# EAGLE design picaxe-08-trainer (EAGLE 7.2.0)
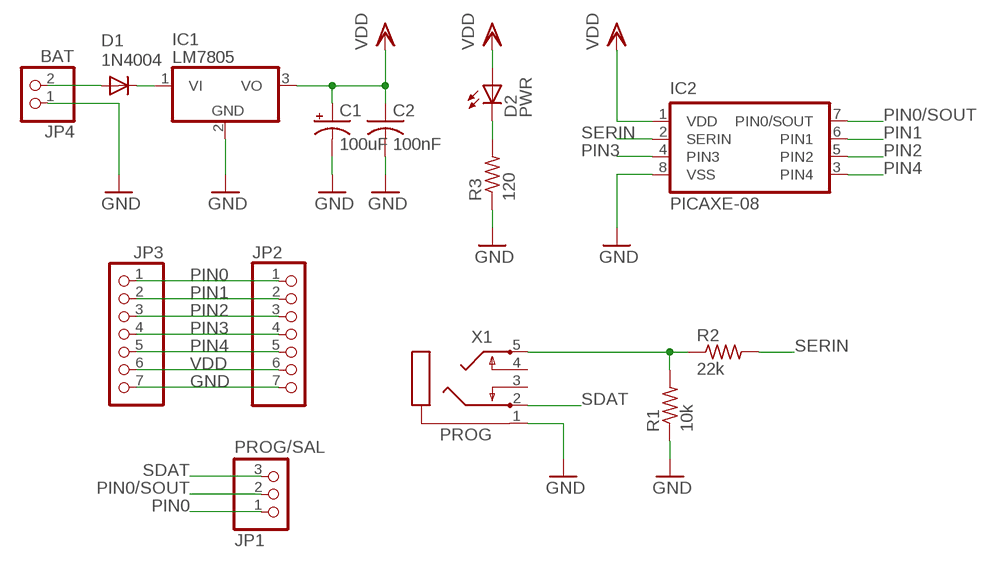
[diagram p0: schematic, sheet 1]

## Parts
C1  100uF  CPOL-USE5-6  [E5-6]
C2  100nF  C-US025-025X050  [C025-025X050]
D1  1N4004  [DO41-10]
D2  PWR  LED3MM  [LED3MM]
IC1  LM7805  7805TV  [TO220V]
IC2  PICAXE-08  [DIL8]
JP1  PROG/SAL  PINHD-1X3  [1X03]
JP2  PINHD-1X7  [1X07]
JP3  PINHD-1X7  [1X07]
JP4  BAT  PINHD-1X2  [1X02]
R1  10k  R-US_0204/7  [0204/7]
R2  22k  R-US_0204/7  [0204/7]
R3  120  R-US_0204/7  [0204/7]
X1  PROG  STEREOJACK  [STX3100]

## Nets
GND: C1.- C2.2 IC1.2(GND) IC2.8(VSS) JP2.7 JP3.7 JP4.1 R1.1 R3.1 X1.1
N$1: D1.C IC1.1(VI)
N$2: R1.2 R2.1 X1.5
N$3: D2.K(C) R3.2
N$4: D1.A JP4.2
PIN0: JP1.1 JP2.1 JP3.1
PIN0/SOUT: IC2.7(PIN0/SOUT) JP1.2
PIN1: IC2.6(PIN1) JP2.2 JP3.2
PIN2: IC2.5(PIN2) JP2.3 JP3.3
PIN3: IC2.4(PIN3) JP2.4 JP3.4
PIN4: IC2.3(PIN4) JP2.5 JP3.5
SDAT: JP1.3 X1.2
SERIN: IC2.2(SERIN) R2.2
VDD: C1.+ C2.1 D2.A IC1.3(VO) IC2.1(VDD) JP2.6 JP3.6
Unconnected: X1.3 X1.4

## Library data of the parts
C1 = rcl:CPOL-US: POLARIZED CAPACITOR, American symbol
C2 = rcl:C-US: CAPACITOR, American symbol
D1 = diode:1N4004: DIODE general purpose rectifier, 1 A
D2 = led:LED: LED OSRAM: - CHIPLED LG R971, LG N971, LY N971, LG Q971, LY Q971, LO R971, LY R971 LH N974, LH R974 LS Q976, LO Q976, LY Q976 LO Q996 - Hyper CHIPLED LW Q18S LB Q993, LB Q99A, LB R99A - SideLED LS A670, LO A670, LY A670, LG A670, LP A670 LB A673, LV A673, LT A673, LW A673 LH A674 LY A675 LS A676, LA A676, LO A676, LY A676, LW A676 LS A679, LY A679, LG A679 - Hyper Micro SIDELED® LS Y876, LA Y876, LO Y876, LY Y876 LT Y87S - SmartLED LW L88C, LW L88S LB L89C, LB L89S, LG L890 LS L89K, LO L89K, LY L89K LS L896, LA L896, LO L896, LY L896 - TOPLED LS T670, LO T670, LY T670, LG T670, LP T670 LSG T670, LSP T670, LSY T670, LOP T670, LYG T670 LG T671, LOG T671, LSG T671 LB T673, LV T673, LT T673, LW T673 LH T674 LS T676, LA T676, LO T676, LY T676, LB T676, LH T676, LSB T676, LW T676 LB T67C, LV T67C, LT T67C, LS T67K, LO T67K, LY T67K, LW E67C LS E67B, LA E67B, LO E67B, LY E67B, LB E67C, LV E67C, LT E67C LW T67C LS T679, LY T679, LG T679 LS T770, LO T770, LY T770, LG T770, LP T770 LB T773, LV T773, LT T773, LW T773 LH T774 LS E675, LA E675, LY E675, LS T675 LS T776, LA T776, LO T776, LY T776, LB T776 LHGB T686 LT T68C, LB T68C - Hyper Mini TOPLED® LB M676 - Mini TOPLED Santana® LG M470 LS M47K, LO M47K, LY M47K Source: http://www.osram.convergy.de LUXEON: - LUMILED® LXK2-PW12-R00, LXK2-PW12-S00, LXK2-PW14-U00, LXK2-PW14-V00 LXK2-PM12-R00, LXK2-PM12-S00, LXK2-PM14-U00 LXK2-PE12-Q00, LXK2-PE12-R00, LXK2-PE12-S00, LXK2-PE14-T00, LXK2-PE14-U00 LXK2-PB12-K00, LXK2-PB12-L00, LXK2-PB12-M00, LXK2-PB14-N00, LXK2-PB14-P00, LXK2-PB14-Q00 LXK2-PR12-L00, LXK2-PR12-M00, LXK2-PR14-Q00, LXK2-PR14-R00 LXK2-PD12-Q00, LXK2-PD12-R00, LXK2-PD12-S00 LXK2-PH12-R00, LXK2-PH12-S00 LXK2-PL12-P00, LXK2-PL12-Q00, LXK2-PL12-R00 Source: www.luxeon.com KINGBRIGHT: KA-3528ASYC Source: www.kingbright.com
IC1 = linear:78*: Positive VOLTAGE REGULATOR Source: http://cache.national.com/ds/LM/LM78L05.pdf http://www.fairchildsemi.com/ds/LM/LM7805.pdf
IC2 = picaxe-4:PICAXE-08: PICAXE-08 Controller 1-4 I/P, 1-4 O/P, 1 ADC
JP1 = pinhead:PINHD-1X3: PIN HEADER
JP2 JP3 = pinhead:PINHD-1X7: PIN HEADER
JP4 = pinhead:PINHD-1X2: PIN HEADER
R1-R3 = resistor:R-US_: RESISTOR, American symbol
X1 = adafruit:STEREOJACK: MIC/HEADPHONE JACK Stereo jack with two switches. Kycon STX3100, CUI SJ1-3555NG and/or 4UCon 05544

## Board
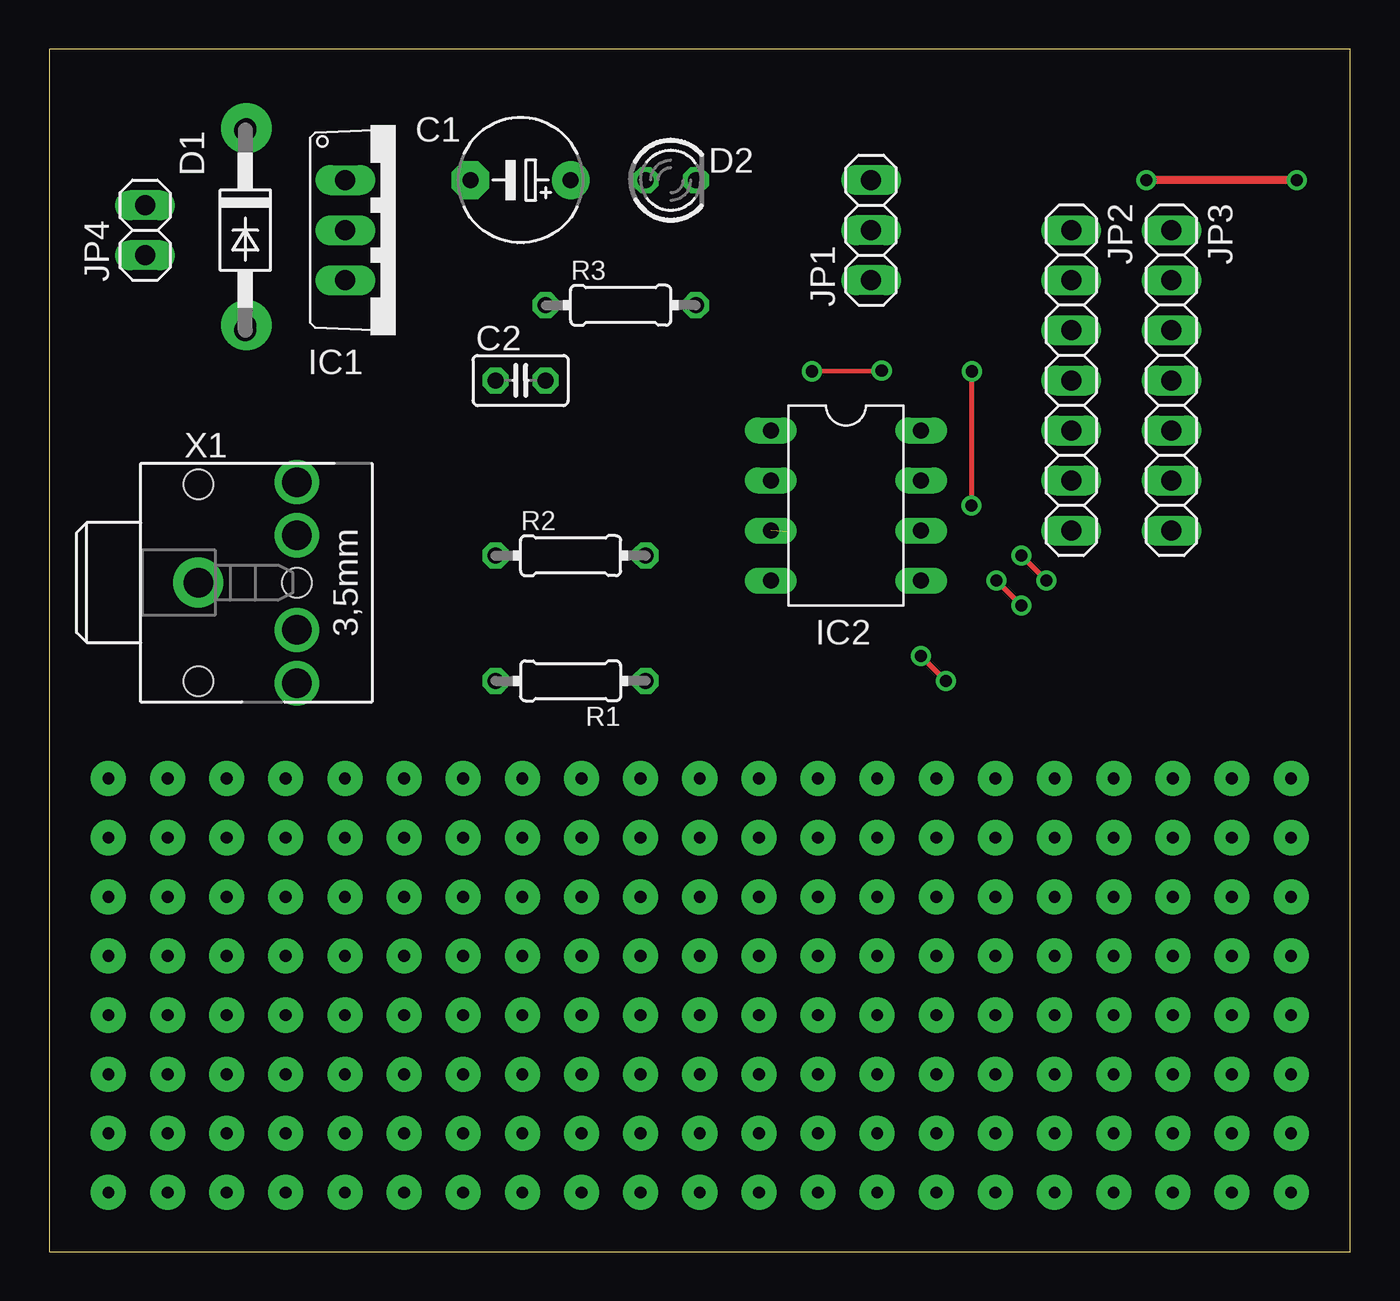
[diagram p1: board, top side]
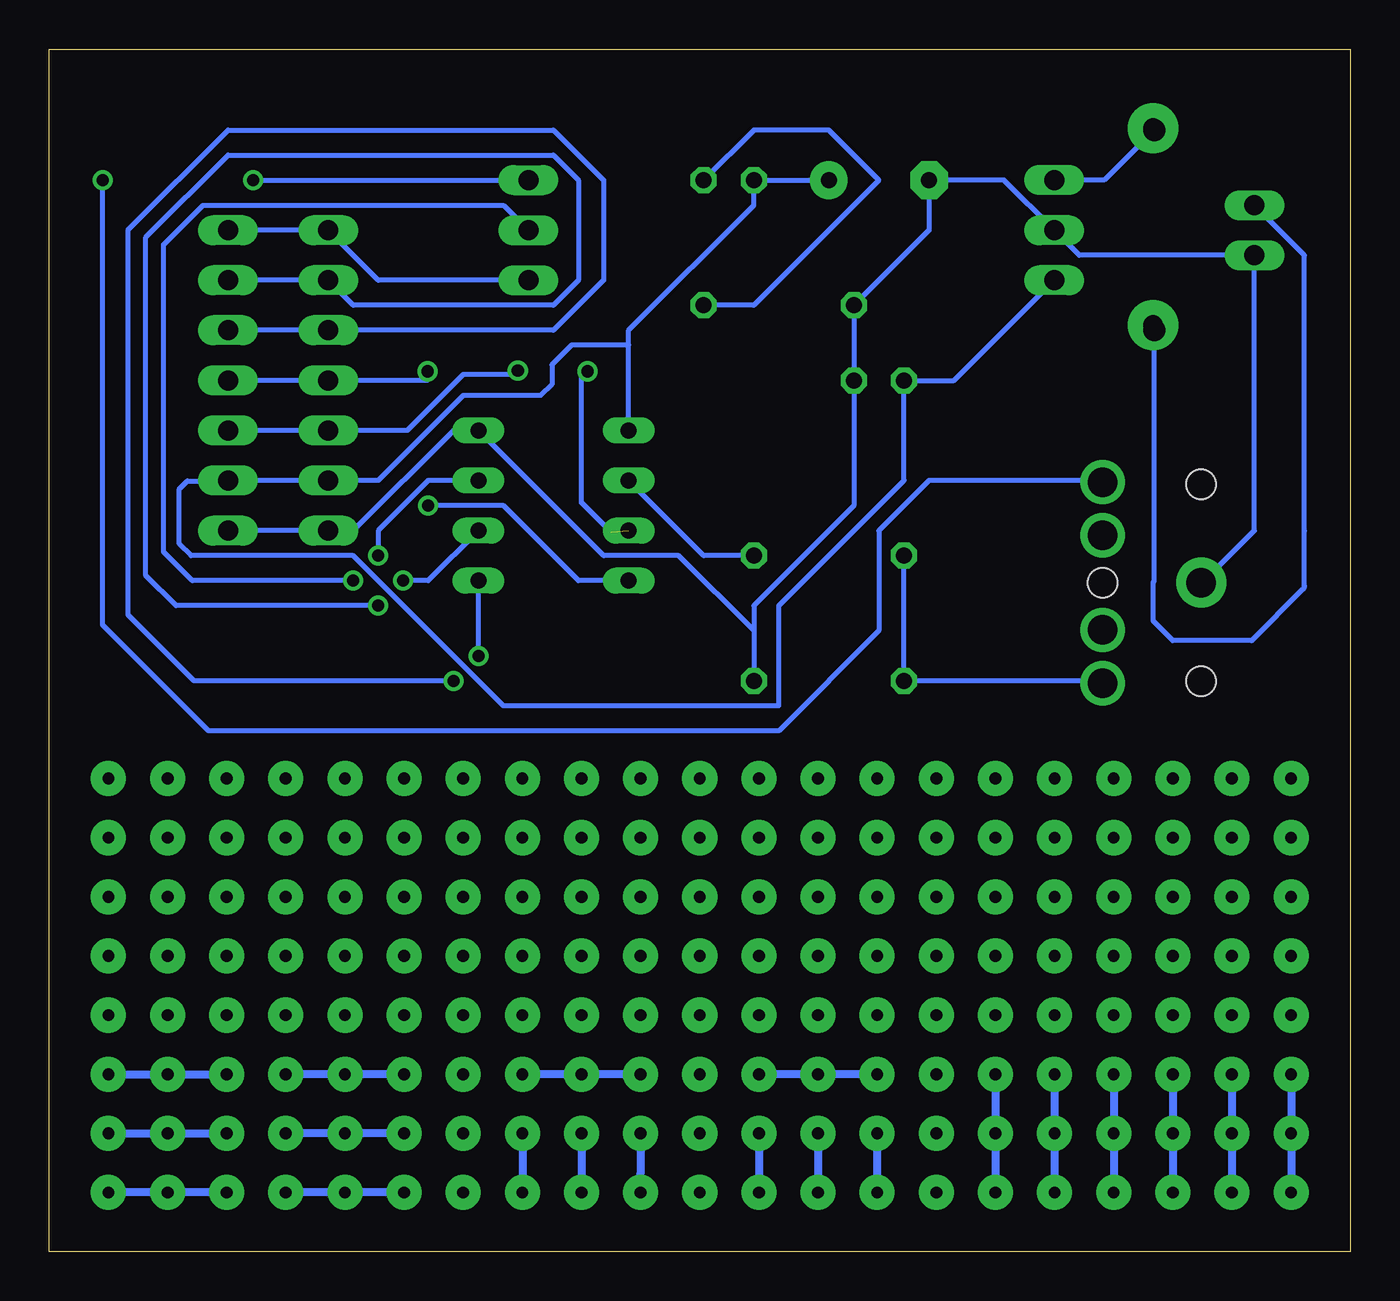
[diagram p2: board, bottom side, seen from below]

Size 66 x 61 mm. Coordinates in mm from the lower left corner, seen from the top.
Outline: 0,0 66,0 66,61 0,61 0,0
Copper layers (1*16): Top 0.035mm / dielectric 1.5mm / Bottom 0.035mm
Design rules "default": minimum track width 10mil, minimum drill 24mil, track to track 8mil, track to pad 8mil, pad to pad 8mil, via to via 8mil, smd to smd 8mil, copper to edge 40mil, drill to drill 8mil, minimum pad ring 10mil, minimum via ring 8mil, stop-mask expansion 4mil, vias tented up to drill 0mil, thermal gap 10mil

### Footprints (pad centres in the part's own frame; a part is rotated, then mirrored left to right if it is on the bottom)
E5-6 = drill 0.813 pad 1.905: + -2.54,0 | drill 0.813 pad 1.905 octagon: - 2.54,0
C025-025X050 = drill 0.813 octagon: 1 -1.27,0; 2 1.27,0
DO41-10 = drill 1.118: A 5.08,0; C -5.08,0
LED3MM = drill 0.813 octagon: A -1.27,0; K 1.27,0
TO220V = drill 1.016 long: 1 -2.54,-2.54; 2 0,-2.54; 3 2.54,-2.54
DIL8 = drill 0.813 long: 1 -3.81,-3.81; 2 -1.27,-3.81; 3 1.27,-3.81; 4 3.81,-3.81; 5 3.81,3.81; 6 1.27,3.81; 7 -1.27,3.81; 8 -3.81,3.81
1X03 = drill 1.016 long: 1 -2.54,0; 2 0,0; 3 2.54,0
1X07 = drill 1.016 long: 1 -7.62,0; 2 -5.08,0; 3 -2.54,0; 4 0,0; 5 2.54,0; 6 5.08,0; 7 7.62,0
1X02 = drill 1.016 long: 1 -1.27,0; 2 1.27,0
0204/7 = drill 0.813 octagon: 1 -3.81,0; 2 3.81,0
STX3100 = drill 1.5 pad 2.54: 1 2.7,-0.1 | drill 1.5: 2 7.7,5; 3 7.7,2.3; 4 7.7,-2.5; 5 7.7,-5.2 | hole 1.5: 2.7,4.9; 2.7,-5.1; 7.7,-0.1

### Placement (x,y rotation side)
C1  23.91,54.36 180 top
C2  23.91,44.2 0 top
D1  9.94,51.82 270 top
D2  31.53,54.36 0 top
IC1  17.56,51.82 270 top
IC2  40.42,37.85 270 top
JP1  41.69,51.82 90 top
JP2  51.85,44.2 270 top
JP3  56.93,44.2 270 top
JP4  4.86,51.82 90 top
R1  26.45,28.96 180 top
R2  26.45,35.31 0 top
R3  28.99,48.01 0 top
X1  4.86,34.04 0 top

### Tracks (layer width: path | path; a pad name or v marks a point on that pad's centre or on a via)
GND
  Bottom 0.254: X1.1 7.4,34.04 4.86,36.58 JP4.1 13.75,50.55 IC1.2 17.56,54.36 C1.- 21.37,51.82 R3.1 C2.2 25.18,37.85 30.26,32.77 30.26,31.5 | 30.26,31.5 R1.1 | 30.26,31.5 34.07,35.31 37.88,35.31 IC2.8 45.5,41.66 50.58,36.58 JP2.7 JP3.7
N$1
  Bottom 0.254: IC1.1 12.48,54.36 D1.C
N$2
  Bottom 0.254: R2.1 R1.2 12.48,28.96 X1.5
N$3
  Bottom 0.254: R3.2 30.26,48.01 23.91,54.36 26.45,56.9 30.26,56.9 D2.K
N$4
  Bottom 0.254: JP4.2 2.32,50.55 2.32,36.58 2.32,33.78 arc45 2.39,33.61 5,31 9,31 10,32 10,33.89 arc45 9.94,34.04 D1.A
N$5  (via drill 1 pad 2.54)
  other vias: 10,57
N$6  (via drill 1 pad 2.54)
  other vias: 10,47
N$7  (via drill 0.6 pad 1.78)
  other vias: 3,24
N$8  (via drill 0.6 pad 1.78)
  other vias: 6,24
N$9  (via drill 0.6 pad 1.78)
  other vias: 9,24
N$10  (via drill 0.6 pad 1.78)
  other vias: 12,24
N$11  (via drill 0.6 pad 1.78)
  other vias: 15,24
N$12  (via drill 0.6 pad 1.78)
  other vias: 18,24
N$13  (via drill 0.6 pad 1.78)
  other vias: 21,24
N$14  (via drill 0.6 pad 1.78)
  other vias: 24,24
N$15  (via drill 0.6 pad 1.78)
  other vias: 27,24
N$16  (via drill 0.6 pad 1.78)
  other vias: 30,24
N$17  (via drill 0.6 pad 1.78)
  other vias: 33,24
N$18  (via drill 0.6 pad 1.78)
  other vias: 36,24
N$19  (via drill 0.6 pad 1.78)
  other vias: 39,24
N$20  (via drill 0.6 pad 1.78)
  other vias: 42,24
N$21  (via drill 0.6 pad 1.78)
  other vias: 45,24
N$22  (via drill 0.6 pad 1.78)
  other vias: 48,24
N$23  (via drill 0.6 pad 1.78)
  other vias: 51,24
N$24  (via drill 0.6 pad 1.78)
  other vias: 54,24
N$25  (via drill 0.6 pad 1.78)
  other vias: 57,24
N$26  (via drill 0.6 pad 1.78)
  other vias: 60,24
N$27  (via drill 0.6 pad 1.78)
  other vias: 63,24
N$28  (via drill 0.6 pad 1.78)
  other vias: 3,21
N$29  (via drill 0.6 pad 1.78)
  other vias: 6,21
N$30  (via drill 0.6 pad 1.78)
  other vias: 9,21
N$31  (via drill 0.6 pad 1.78)
  other vias: 12,21
N$32  (via drill 0.6 pad 1.78)
  other vias: 15,21
N$33  (via drill 0.6 pad 1.78)
  other vias: 18,21
N$34  (via drill 0.6 pad 1.78)
  other vias: 21,21
N$35  (via drill 0.6 pad 1.78)
  other vias: 24,21
N$36  (via drill 0.6 pad 1.78)
  other vias: 27,21
N$37  (via drill 0.6 pad 1.78)
  other vias: 30,21
N$38  (via drill 0.6 pad 1.78)
  other vias: 33,21
N$39  (via drill 0.6 pad 1.78)
  other vias: 36,21
N$40  (via drill 0.6 pad 1.78)
  other vias: 39,21
N$41  (via drill 0.6 pad 1.78)
  other vias: 42,21
N$42  (via drill 0.6 pad 1.78)
  other vias: 45,21
N$43  (via drill 0.6 pad 1.78)
  other vias: 48,21
N$44  (via drill 0.6 pad 1.78)
  other vias: 51,21
N$45  (via drill 0.6 pad 1.78)
  other vias: 54,21
N$46  (via drill 0.6 pad 1.78)
  other vias: 57,21
N$47  (via drill 0.6 pad 1.78)
  other vias: 60,21
N$48  (via drill 0.6 pad 1.78)
  other vias: 63,21
N$49  (via drill 0.6 pad 1.78)
  other vias: 3,18
N$50  (via drill 0.6 pad 1.78)
  other vias: 6,18
N$51  (via drill 0.6 pad 1.78)
  other vias: 9,18
N$52  (via drill 0.6 pad 1.78)
  other vias: 12,18
N$53  (via drill 0.6 pad 1.78)
  other vias: 15,18
N$54  (via drill 0.6 pad 1.78)
  other vias: 18,18
N$55  (via drill 0.6 pad 1.78)
  other vias: 21,18
N$56  (via drill 0.6 pad 1.78)
  other vias: 24,18
N$57  (via drill 0.6 pad 1.78)
  other vias: 27,18
N$58  (via drill 0.6 pad 1.78)
  other vias: 30,18
N$59  (via drill 0.6 pad 1.78)
  other vias: 33,18
N$60  (via drill 0.6 pad 1.78)
  other vias: 36,18
N$61  (via drill 0.6 pad 1.78)
  other vias: 39,18
N$62  (via drill 0.6 pad 1.78)
  other vias: 42,18
N$63  (via drill 0.6 pad 1.78)
  other vias: 45,18
N$64  (via drill 0.6 pad 1.78)
  other vias: 48,18
N$65  (via drill 0.6 pad 1.78)
  other vias: 51,18
N$66  (via drill 0.6 pad 1.78)
  other vias: 54,18
N$67  (via drill 0.6 pad 1.78)
  other vias: 57,18
N$68  (via drill 0.6 pad 1.78)
  other vias: 60,18
N$69  (via drill 0.6 pad 1.78)
  other vias: 63,18
N$70  (via drill 0.6 pad 1.78)
  other vias: 3,15
N$71  (via drill 0.6 pad 1.78)
  other vias: 6,15
N$72  (via drill 0.6 pad 1.78)
  other vias: 9,15
N$73  (via drill 0.6 pad 1.78)
  other vias: 12,15
N$74  (via drill 0.6 pad 1.78)
  other vias: 15,15
N$75  (via drill 0.6 pad 1.78)
  other vias: 18,15
N$76  (via drill 0.6 pad 1.78)
  other vias: 21,15
N$77  (via drill 0.6 pad 1.78)
  other vias: 24,15
N$78  (via drill 0.6 pad 1.78)
  other vias: 27,15
N$79  (via drill 0.6 pad 1.78)
  other vias: 30,15
N$80  (via drill 0.6 pad 1.78)
  other vias: 33,15
N$81  (via drill 0.6 pad 1.78)
  other vias: 36,15
N$82  (via drill 0.6 pad 1.78)
  other vias: 39,15
N$83  (via drill 0.6 pad 1.78)
  other vias: 42,15
N$84  (via drill 0.6 pad 1.78)
  other vias: 45,15
N$85  (via drill 0.6 pad 1.78)
  other vias: 48,15
N$86  (via drill 0.6 pad 1.78)
  other vias: 51,15
N$87  (via drill 0.6 pad 1.78)
  other vias: 54,15
N$88  (via drill 0.6 pad 1.78)
  other vias: 57,15
N$89  (via drill 0.6 pad 1.78)
  other vias: 60,15
N$90  (via drill 0.6 pad 1.78)
  other vias: 63,15
N$91  (via drill 0.6 pad 1.78)
  other vias: 3,12
N$92  (via drill 0.6 pad 1.78)
  other vias: 6,12
N$93  (via drill 0.6 pad 1.78)
  other vias: 9,12
N$94  (via drill 0.6 pad 1.78)
  other vias: 12,12
N$95  (via drill 0.6 pad 1.78)
  other vias: 15,12
N$96  (via drill 0.6 pad 1.78)
  other vias: 18,12
N$97  (via drill 0.6 pad 1.78)
  other vias: 21,12
N$98  (via drill 0.6 pad 1.78)
  other vias: 24,12
N$99  (via drill 0.6 pad 1.78)
  other vias: 27,12
N$100  (via drill 0.6 pad 1.78)
  other vias: 30,12
N$101  (via drill 0.6 pad 1.78)
  other vias: 33,12
N$102  (via drill 0.6 pad 1.78)
  other vias: 36,12
N$103  (via drill 0.6 pad 1.78)
  other vias: 39,12
N$104  (via drill 0.6 pad 1.78)
  other vias: 42,12
N$105  (via drill 0.6 pad 1.78)
  other vias: 45,12
N$106  (via drill 0.6 pad 1.78)
  other vias: 48,12
N$107  (via drill 0.6 pad 1.78)
  other vias: 51,12
N$108  (via drill 0.6 pad 1.78)
  other vias: 54,12
N$109  (via drill 0.6 pad 1.78)
  other vias: 57,12
N$110  (via drill 0.6 pad 1.78)
  other vias: 60,12
N$111  (via drill 0.6 pad 1.78)
  other vias: 63,12
N$112  (via drill 0.6 pad 1.78)
  Bottom 0.406: v3,9 v3,3
N$113  (via drill 0.6 pad 1.78)
  Bottom 0.406: v6,9 v6,3
N$114  (via drill 0.6 pad 1.78)
  Bottom 0.406: v9,9 v9,3
N$115  (via drill 0.6 pad 1.78)
  Bottom 0.406: v12,9 v12,3
N$116  (via drill 0.6 pad 1.78)
  Bottom 0.406: v15,9 v15,3
N$117  (via drill 0.6 pad 1.78)
  Bottom 0.406: v18,9 v18,3
N$118  (via drill 0.6 pad 1.78)
  other vias: 21,9
N$119  (via drill 0.6 pad 1.78)
  Bottom 0.406: v24,9 v30,9
N$120  (via drill 0.6 pad 1.78)
  other vias: 27,9
N$122  (via drill 0.6 pad 1.78)
  other vias: 33,9
N$123  (via drill 0.6 pad 1.78)
  Bottom 0.406: v36,9 v42,9
N$124  (via drill 0.6 pad 1.78)
  other vias: 39,9
N$126  (via drill 0.6 pad 1.78)
  other vias: 45,9
N$127  (via drill 0.6 pad 1.78)
  Bottom 0.406: v48,9 v54,9
N$128  (via drill 0.6 pad 1.78)
  other vias: 51,9
N$131  (via drill 0.6 pad 1.78)
  other vias: 60,9
N$132  (via drill 0.6 pad 1.78)
  Bottom 0.406: v63,9 v57,9
N$133  (via drill 0.6 pad 1.78)
  other vias: 3,6
N$134  (via drill 0.6 pad 1.78)
  other vias: 6,6
N$135  (via drill 0.6 pad 1.78)
  other vias: 9,6
N$136  (via drill 0.6 pad 1.78)
  other vias: 12,6
N$137  (via drill 0.6 pad 1.78)
  other vias: 15,6
N$138  (via drill 0.6 pad 1.78)
  other vias: 18,6
N$139  (via drill 0.6 pad 1.78)
  other vias: 21,6
N$140  (via drill 0.6 pad 1.78)
  Bottom 0.406: v24,6 v24,3
N$141  (via drill 0.6 pad 1.78)
  Bottom 0.406: v27,6 v27,3
N$142  (via drill 0.6 pad 1.78)
  Bottom 0.406: v30,6 v30,3
N$143  (via drill 0.6 pad 1.78)
  other vias: 33,6
N$144  (via drill 0.6 pad 1.78)
  Bottom 0.406: v36,6 36,4 v36,3
N$145  (via drill 0.6 pad 1.78)
  Bottom 0.406: v39,6 v39,3
N$146  (via drill 0.6 pad 1.78)
  Bottom 0.406: v42,6 v42,3
N$147  (via drill 0.6 pad 1.78)
  other vias: 45,6
N$148  (via drill 0.6 pad 1.78)
  Bottom 0.406: v48,6 v54,6
N$149  (via drill 0.6 pad 1.78)
  other vias: 51,6
N$152  (via drill 0.6 pad 1.78)
  other vias: 60,6
N$153  (via drill 0.6 pad 1.78)
  Bottom 0.406: v63,6 v57,6
N$160  (via drill 0.6 pad 1.78)
  other vias: 21,3
N$164  (via drill 0.6 pad 1.78)
  other vias: 33,3
N$168  (via drill 0.6 pad 1.78)
  other vias: 45,3
N$169  (via drill 0.6 pad 1.78)
  Bottom 0.406: v48,3 v54,3
N$170  (via drill 0.6 pad 1.78)
  other vias: 51,3
N$172  (via drill 0.6 pad 1.78)
  Bottom 0.406: v57,3 v63,3
N$173  (via drill 0.6 pad 1.78)
  other vias: 60,3
PIN0
  Bottom 0.254: JP1.1 49.31,49.28 JP2.1 JP3.1
PIN0/SOUT  (via drill 0.61)
  Top 0.254: v49.31,35.31 v50.58,34.04
  Bottom 0.254: IC2.7 46.77,39.12 49.31,36.58 v49.31,35.31 | JP1.2 42.96,53.09 58.2,53.09 60.2,51.09 60.2,35.5 58.74,34.04 v50.58,34.04
PIN1  (via drill 0.61)
  Top 0.254: v48.04,34.04 v49.31,32.77
  Bottom 0.254: IC2.6 46.77,34.04 v48.04,34.04 | JP3.2 JP2.2 50.58,48.01 40.42,48.01 39.15,49.28 39.15,54.36 40.42,55.63 56.93,55.63 61.1,51.46 61.1,34.3 59.57,32.77 v49.31,32.77
PIN2  (via drill 0.61)
  Top 0.254: v44.23,30.23 v45.5,28.96
  Bottom 0.254: v44.23,30.23 IC2.5 | JP3.3 JP2.3 40.42,46.74 37.88,49.28 37.88,54.36 40.42,56.9 56.93,56.9 62.01,51.82 62,51.81 62,32.3 58.66,28.96 v45.5,28.96
PIN3  (via drill 0.61)
  Top 0.254: v46.77,37.85 46.81,37.85 v46.81,44.66
  Bottom 0.254: IC2.4 39.15,34.04 42.96,37.85 v46.77,37.85 | JP3.4 JP2.4 46.81,44.2 v46.81,44.66
PIN4  (via drill 0.61)  (1 unrouted)
  Top 0.254: v38.69,44.66 v42.23,44.7
  Bottom 0.254: JP3.5 JP2.5 47.84,41.66 45,44.5 42.43,44.5 v42.23,44.7 | v38.69,44.66 39,44.66 39,38 37.5,36.5
SDAT  (via drill 0.61)
  Top 0.406: v63.28,54.36 v55.66,54.36
  Bottom 0.254: v55.66,54.36 JP1.3 | X1.2 12.48,39.12 21.37,39.12 23.91,36.58 23.91,31.5 28.99,26.42 57.92,26.42 63.3,31.8 63.3,54.34 v63.28,54.36
SERIN
  Bottom 0.254: R2.2 32.8,35.31 IC2.2
VDD
  Bottom 0.254: IC1.3 20.1,44.2 C2.1 22.64,39.12 28.99,32.77 28.99,27.69 42.96,27.69 50.58,35.31 58.81,35.31 59.4,35.9 59.4,38.7 59,39.1 56.95,39.1 JP3.6 JP2.6 49.31,39.12 45,43.43 41.07,43.43 40.5,44 40.5,45 39.5,46 36.61,46 | IC2.1 36.61,46 | 36.61,46 36.61,46.74 30.26,53.09 D2.A C1.+